# EAGLE design backpac (EAGLE 5.11)
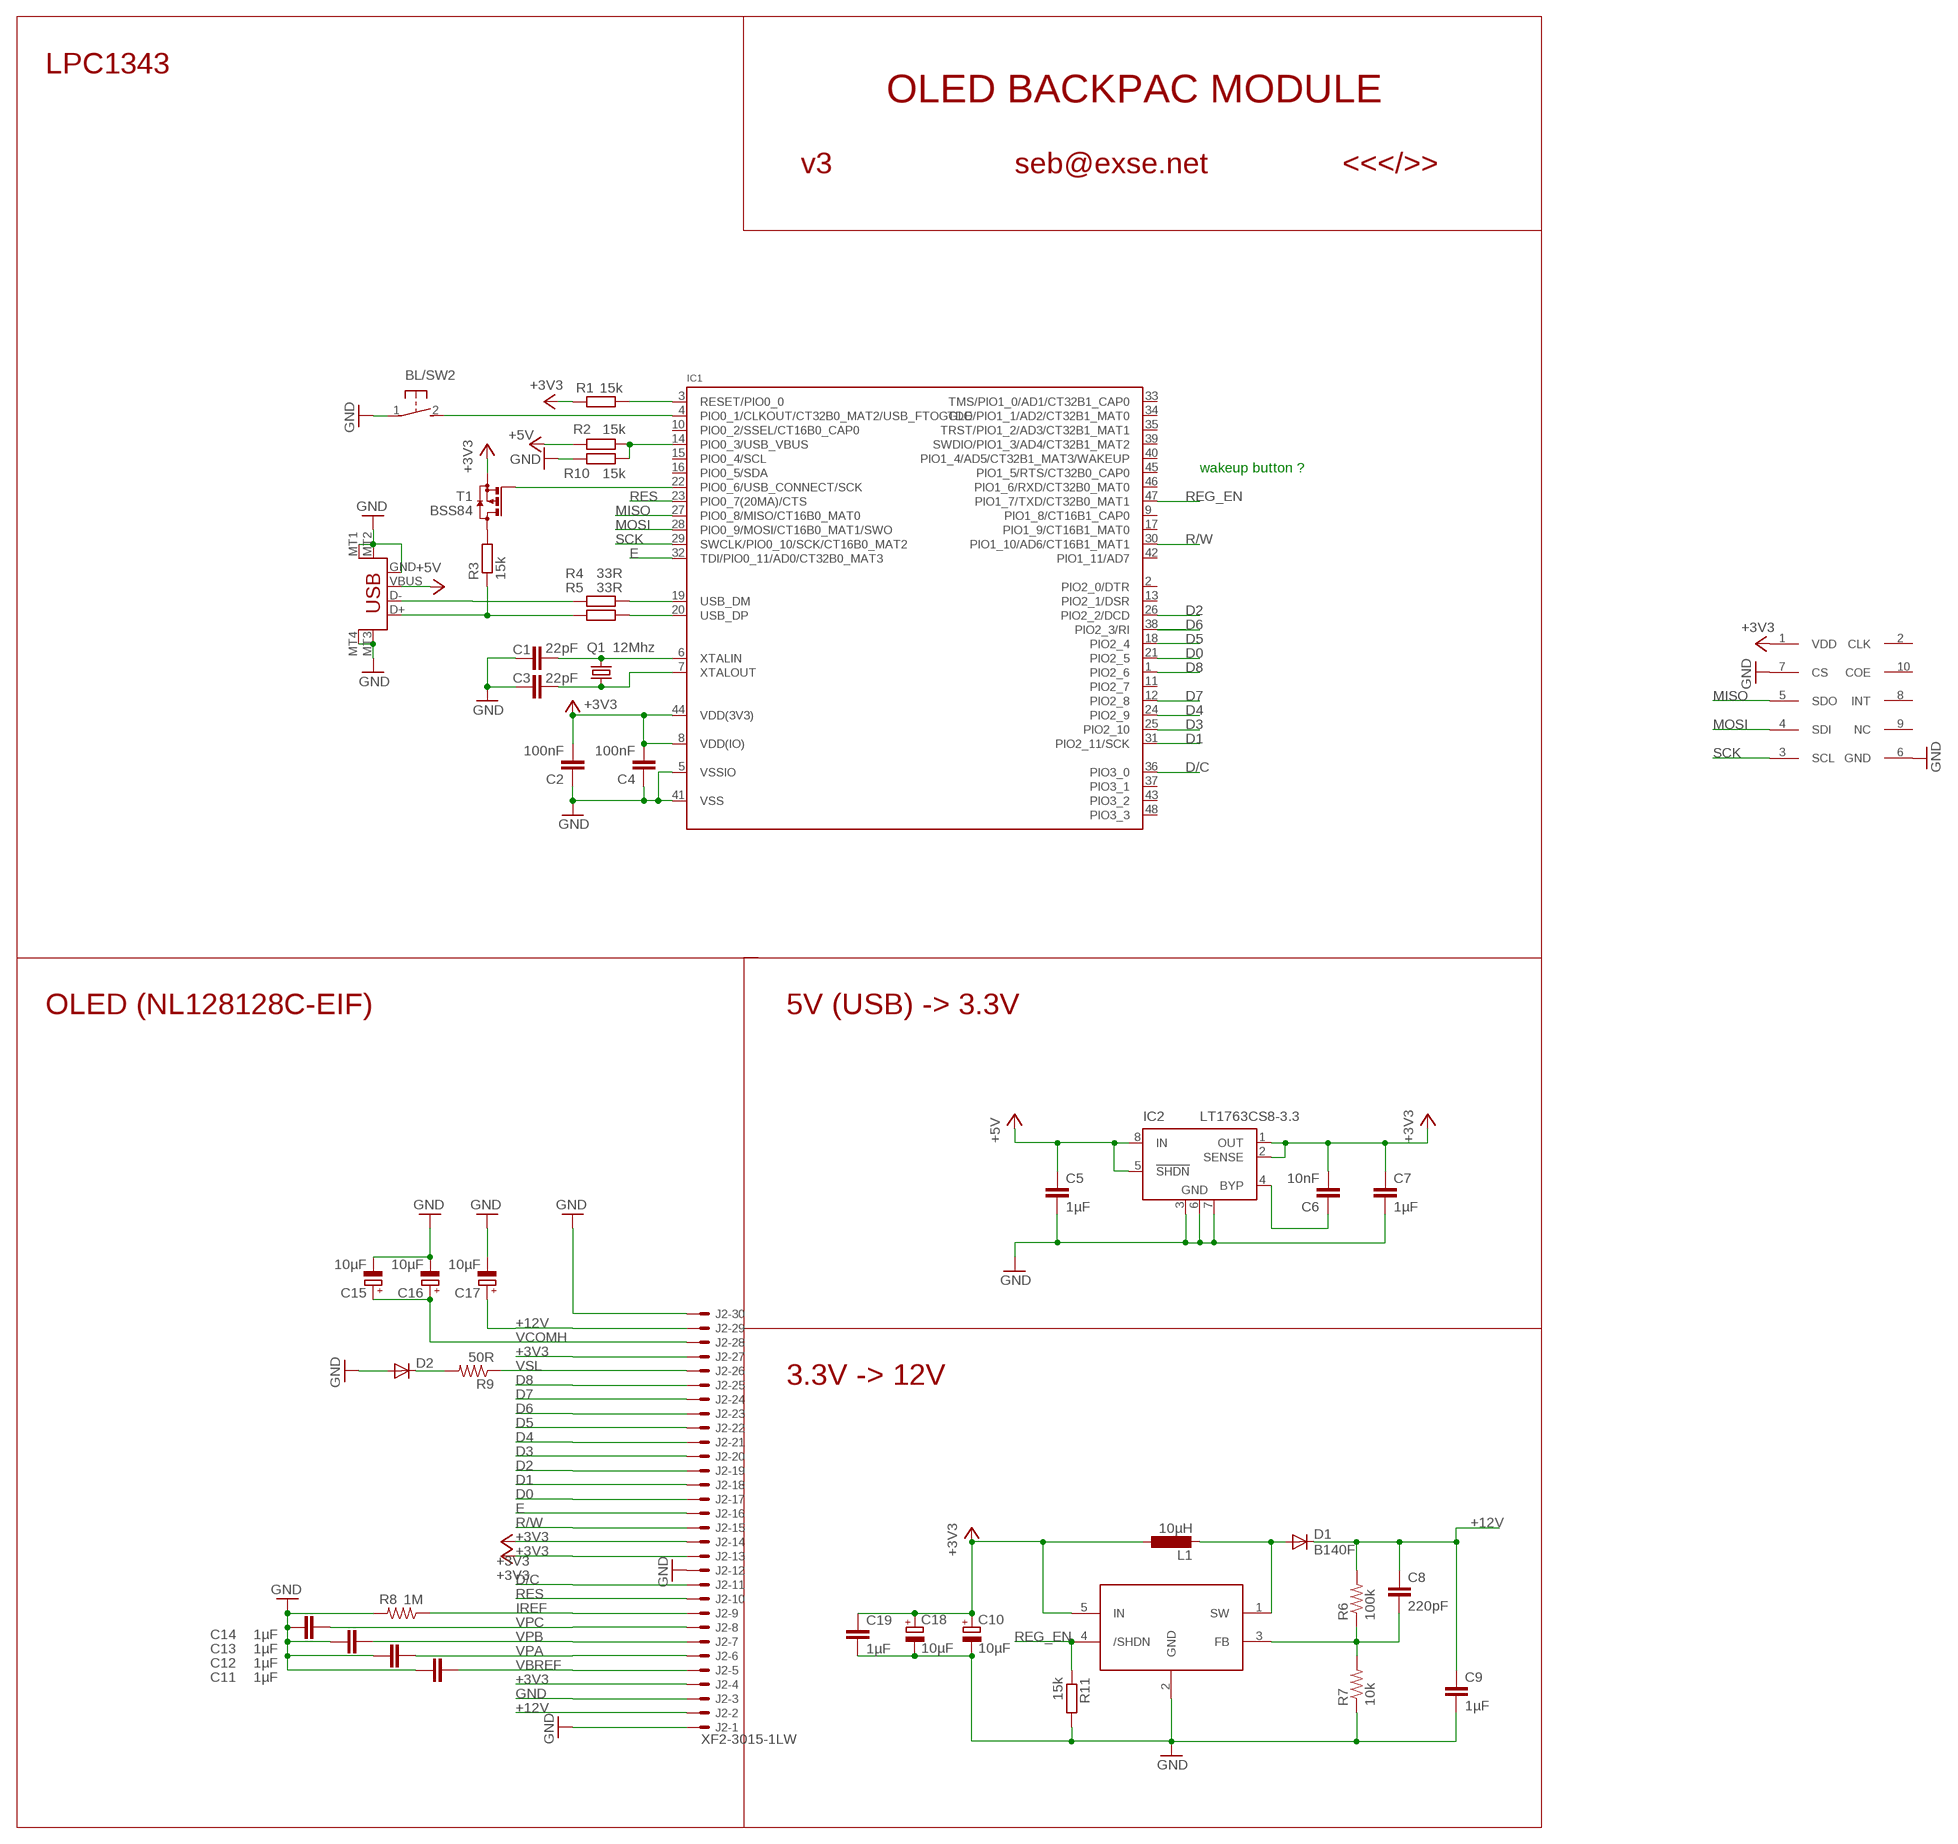
[diagram p0: schematic, sheet 1]

## Parts
BL/SW2  SWITCH_MCTAEF  [SWITCH_MCTAEF]
C1  22pF  C-EUC0402  [C0402]
C2  100nF  C-EUC0402  [C0402]
C3  22pF  C-EUC0402  [C0402]
C4  100nF  C-EUC0402  [C0402]
C5  1µF  CAP0805  [0805]
C6  10nF  C-EUC0402  [C0402]
C7  1µF  CAP0805  [0805]
C8  220pF  CAP0805  [0805]
C9  1µF  CAP0805  [0805]
C10  10µF  CPOL-EUSMCA  [SMC_A]
C11  1µF  CAP0805  [0805]
C12  1µF  CAP0805  [0805]
C13  1µF  CAP0805  [0805]
C14  1µF  CAP0805  [0805]
C15  10µF  CPOL-EUSMCA  [SMC_A]
C16  10µF  CPOL-EUSMCA  [SMC_A]
C17  10µF  CPOL-EUSMCA  [SMC_A]
C18  10µF  CPOL-EUSMCA  [SMC_A]
C19  1µF  CAP0805  [0805]
D1  B140F  DIODE-DO214AC  [DO214AC]
D2  DIODESOD  [SOD-323]
IC1  LPC1343_QFP  [LQFP48]
IC2  LT1763CS8-3.3  [SOIC8]
IC3  LM27313  [SOT23-5L]
IC5  RV-2123-C2  [RV-2123-C2]
J2  XF2-3015-1LW  [XF2H-3015-1LW]
L1  10µH  L-EUL1812  [L1812]
Q1  12Mhz  MT-OSCILLATOR  [MT]
R1  15k  R-EU_R0402  [R0402]
R2  15k  R-EU_R0402  [R0402]
R3  15k  R-EU_R0402  [R0402]
R4  33R  R-EU_R0402  [R0402]
R5  33R  R-EU_R0402  [R0402]
R6  100k  RESISTOR0805-RES  [0805]
R7  10k  RESISTOR0805-RES  [0805]
R8  1M  RESISTOR0805-RES  [0805]
R9  50R  RESISTOR0805-RES  [0805]
R10  15k  R-EU_R0402  [R0402]
R11  15k  R-EU_R0402  [R0402]
T1  BSS84  [SOT23]
X1  USB-MICROB  [USB-MICROB]

## Nets
+3V3: C2.2 C4.2 C6.2 C7.1 C10.+ C18.+ C19.1 IC1.8(VDD(IO)) IC1.44(VDD(3V3)) IC2.1(OUT) IC2.2(SENSE) IC3.5(IN) IC5.1(VDD) J2.4 J2.13 J2.14 J2.27 L1.1 R1.2 T1.2(S)
+5V: C5.1 IC2.5(!SHDN) IC2.8(IN) R2.2 X1.VBUS
+12V: C8.1 C9.1 C17.+ D1.C J2.2 J2.29 R6.2
D0: IC1.21(PIO2_5) J2.17
D1: IC1.31(PIO2_11/SCK) J2.18
D2: IC1.26(PIO2_2/DCD) J2.19
D3: IC1.25(PIO2_10) J2.20
D4: IC1.24(PIO2_9) J2.21
D5: IC1.18(PIO2_4) J2.22
D6: IC1.38(PIO2_3/RI) J2.23
D7: IC1.12(PIO2_8) J2.24
D8: IC1.1(PIO2_6) J2.25
D/C: IC1.36(PIO3_0) J2.11
E: IC1.32(TDI/PIO0_11/AD0/CT32B0_MAT3) J2.16
GND: BL/SW2.1 C1.1 C2.1 C3.1 C4.1 C5.2 C7.2 C9.2 C10.- C11.1 C12.1 C13.1 C14.1 C15.- C16.- C17.- C18.- C19.2 D2.2(A) IC1.5(VSSIO) IC1.41(VSS) IC2.3(GND) IC2.6(GND) IC2.7(GND) IC3.2(GND) IC5.6(GND) IC5.7(CS) J2.1 J2.3 J2.12 J2.30 R7.1 R8.2 R10.2 R11.2 X1.GND X1.MT1(GND) X1.MT2(GND) X1.MT3(GND) X1.MT4(GND)
IREF: J2.9 R8.1
MISO: IC1.27(PIO0_8/MISO/CT16B0_MAT0) IC5.5(SDO)
MOSI: IC1.28(PIO0_9/MOSI/CT16B0_MAT1/SWO) IC5.4(SDI)
N$1: D1.A IC3.1(SW) L1.2
N$2: D2.1(C) R9.2
N$3: C3.2 IC1.7(XTALOUT) Q1.1
N$4: C1.2 IC1.6(XTALIN) Q1.3
N$5: C6.1 IC2.4(BYP)
N$6: C8.2 IC3.3(FB) R6.1 R7.2
N$7: IC1.3(RESET/PIO0_0) R1.1
N$8: R3.2 T1.3(D)
N$9: IC1.22(PIO0_6/USB_CONNECT/SCK) T1.1(G)
N$10: R3.1 R5.2 X1.D+
N$11: R4.2 X1.D-
N$12: IC1.14(PIO0_3/USB_VBUS) R2.1 R10.1
N$14: IC1.19(USB_DM) R4.1
N$21: BL/SW2.2 IC1.4(PIO0_1/CLKOUT/CT32B0_MAT2/USB_FTOGGLE)
N$24: IC1.20(USB_DP) R5.1
R/W: IC1.30(PIO1_10/AD6/CT16B1_MAT1) J2.15
REG_EN: IC1.47(PIO1_7/TXD/CT32B0_MAT1) IC3.4(/SHDN) R11.1
RES: IC1.23(PIO0_7(20MA)/CTS) J2.10
SCK: IC1.29(SWCLK/PIO0_10/SCK/CT16B0_MAT2) IC5.3(SCL)
VBREF: C11.2 J2.5
VCOMH: C15.+ C16.+ J2.28
VPA: C12.2 J2.6
VPB: C13.2 J2.7
VPC: C14.2 J2.8
VSL: J2.26 R9.1
Unconnected: IC1.2(PIO2_0/DTR) IC1.9(PIO1_8/CT16B1_CAP0) IC1.10(PIO0_2/SSEL/CT16B0_CAP0) IC1.11(PIO2_7) IC1.13(PIO2_1/DSR) IC1.15(PIO0_4/SCL) IC1.16(PIO0_5/SDA) IC1.17(PIO1_9/CT16B1_MAT0) IC1.33(TMS/PIO1_0/AD1/CT32B1_CAP0) IC1.34(TDO/PIO1_1/AD2/CT32B1_MAT0) IC1.35(TRST/PIO1_2/AD3/CT32B1_MAT1) IC1.37(PIO3_1) IC1.39(SWDIO/PIO1_3/AD4/CT32B1_MAT2) IC1.40(PIO1_4/AD5/CT32B1_MAT3/WAKEUP) IC1.42(PIO1_11/AD7) IC1.43(PIO3_2) IC1.45(PIO1_5/RTS/CT32B0_CAP0) IC1.46(PIO1_6/RXD/CT32B0_MAT0) IC1.48(PIO3_3) IC5.2(CLK) IC5.8(INT) IC5.9(NC) IC5.10(COE)

## Notes on the sheet
- LPC1343
- OLED BACKPAC MODULE
- v3 | seb@exse.net | <<</>>
- wakeup button ?
- OLED (NL128128C-EIF) | 5V (USB) -> 3.3V
- 3.3V -> 12V

## Library data of the parts
BL/SW2 = seb:SWITCH_MCTAEF
C1-C4 C6 = rcl:C-EU: CAPACITOR, European symbol
C5 C7-C9 C11-C14 C19 = SparkFun:CAP: Capacitor Standard 0603 ceramic capacitor, and 0.1" leaded capacitor.
C10 C15-C18 = rcl:CPOL-EU: POLARIZED CAPACITOR, European symbol
D1 = diode:DIODE-: DIODE
D2 = SparkFun:DIODE: Diode These are standard reverse protection diodes and small signal diodes. SMA package can handle up to about 1A. SOD-323 can handle about 200mA. What the SOD-323 package when ordering, there are some mfgs out there that are 5-pin packages.
IC1 = microbuilder:LPC1343_QFP: LPC1343 72 MHz 32-bit ARM Cortex-M3 microcontroller. 32 kB Flash, 8 kB SRAM, USB Device Mouser: 771-LPC1343FBD48151 Digikey: 568-4945-ND; DIGIKEY#: 568-4945-ND; MANF: NXP; MANF#: LPC1343FBD48,151
IC2 = linear-technology:LT1763CS8: 500mA, Low Noise, LDO Micropower Regulators Source: http://cds.linear.com/docs/Datasheet/1763ff.pdf; MPN: LT1763CS8-3.3; OC_FARNELL: 1273617; OC_NEWARK: 57M6055
IC3 = seb:LM27313
IC5 = seb:RV-2123-C2
J2 = con-omron:XF2*-30?: OMRON FPC Connector Source : http://www.omron.com/ecb/products/pdf/fpc.pdf; OC_FARNELL: unknown; OC_NEWARK: unknown
L1 = resistor:L-EU: INDUCTOR, European symbol
Q1 = seb:MT-OSCILLATOR
R1-R5 R10 R11 = rcl:R-EU_: RESISTOR, European symbol
R6-R9 = SparkFun:RESISTOR: Resistor Basic schematic elements and footprints for 0603, 1206, and PTH resistors.
T1 = transistor-small-signal:BSS84: P-CHANNEL MOS FET
X1 = SparkFun:USB: USB Connectors USB-B-PTH is fully proven SKU : PRT-00139 USB-miniB is fully proven SKU : PRT-00587 USB-A-PCB is untested. USB-A-H is throughly reviewed, but untested. Spark Fun Electronics SKU : PRT-00437 USB-B-SMT is throughly reviewed, but untested. Needs silkscreen touching up. USB-A-S has not been used/tested USB-MB-H has not been used/tested

## Board
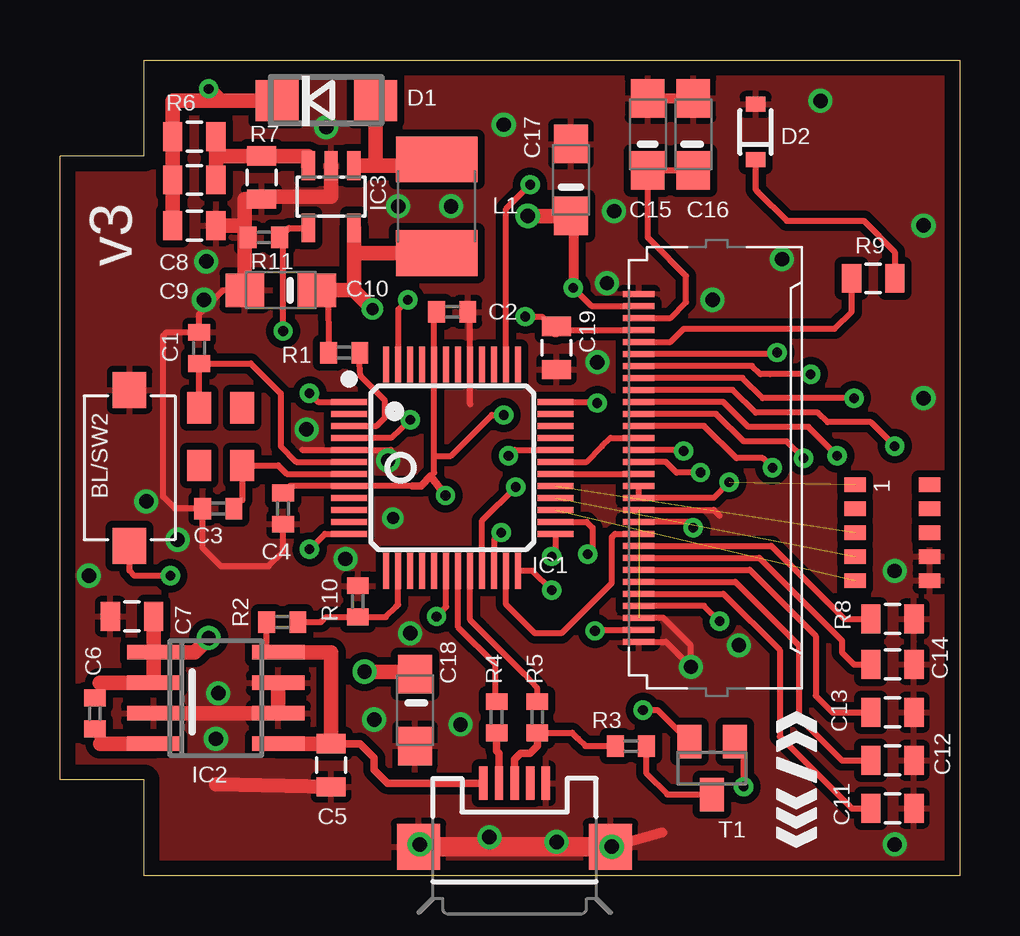
[diagram p1: board, top side]
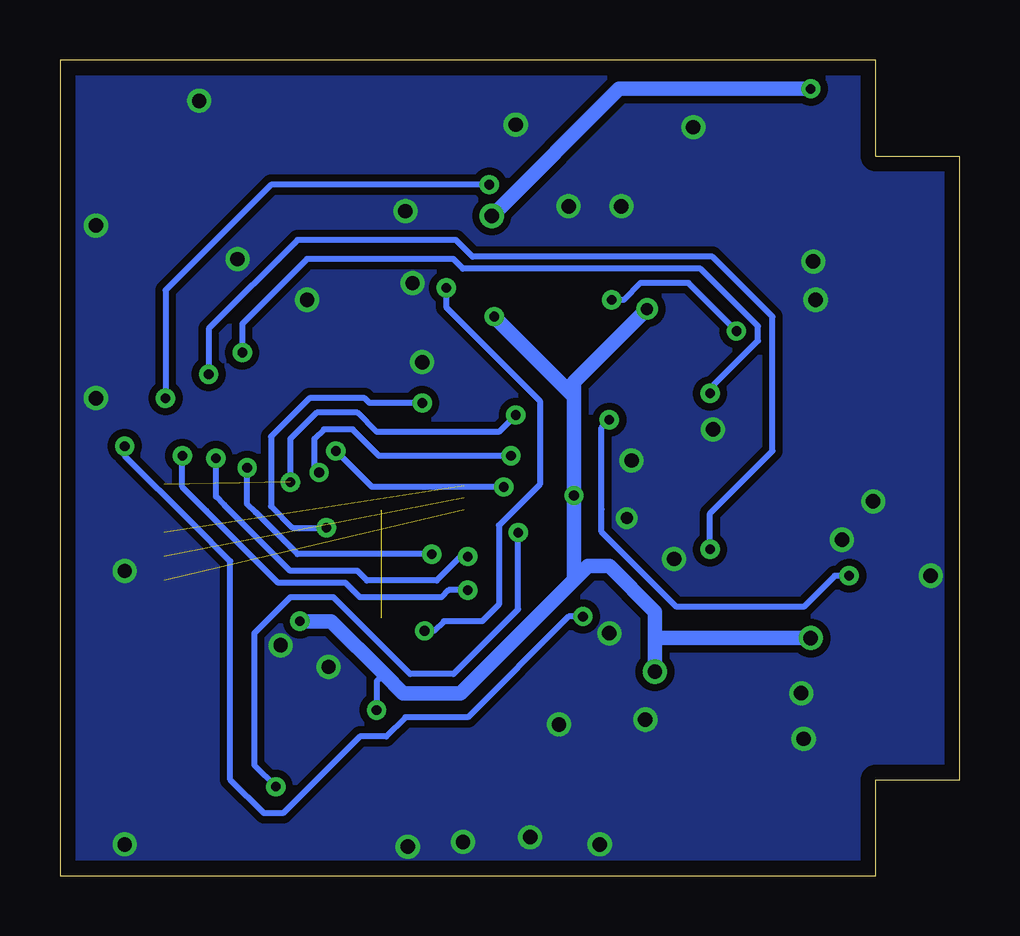
[diagram p2: board, bottom side, seen from below]

Size 37.5 x 34 mm. Coordinates in mm from the lower left corner, seen from the top.
Outline: 37.5,34 37.5,0 3.5,0 3.5,4 0,4 0,30 3.5,30 3.5,34 37.5,34
Copper layers (1*16): Top 0.035mm / dielectric 1.5mm / Bottom 0.035mm
Design rules "default *": minimum track width 9mil, minimum drill 0.4mm, track to track 8mil, track to pad 8mil, pad to pad 8mil, via to via 8mil, smd to smd 8mil, copper to edge 25mil, drill to drill 8mil, minimum pad ring 10mil, minimum via ring 8mil, stop-mask expansion 4mil, vias tented up to drill 30mil, thermal gap 10mil

### Footprints (pad centres in the part's own frame; a part is rotated, then mirrored left to right if it is on the bottom)
SWITCH_MCTAEF = smd 1.5 x 1.4: 1 -3.25,0; 2 3.25,0
C0402 = smd 0.7 x 0.9: 1 -0.65,0; 2 0.65,0
0805 = smd 0.8 x 1.2: 1 -0.9,0; 2 0.9,0
SMC_A = smd 1.6 x 1.4: + -1.5,0; - 1.5,0
DO214AC = smd 1.8 x 1.7: A 2.05,0; C -2.05,0
SOD-323 = smd 0.63 x 0.83: 1 -1.15,0; 2 1.15,0
LQFP48 = smd 1.5 x 0.25: 1 -4.3,2.75; 2 -4.3,2.25; 3 -4.3,1.75; 4 -4.3,1.25; 5 -4.3,0.75; 6 -4.3,0.25; 7 -4.3,-0.25; 8 -4.3,-0.75; 9 -4.3,-1.25; 10 -4.3,-1.75; 11 -4.3,-2.25; 12 -4.3,-2.75; 25 4.3,-2.75; 26 4.3,-2.25; 27 4.3,-1.75; 28 4.3,-1.25; 29 4.3,-0.75; 30 4.3,-0.25; 31 4.3,0.25; 32 4.3,0.75; 33 4.3,1.25; 34 4.3,1.75; 35 4.3,2.25; 36 4.3,2.75 | smd 0.25 x 1.5: 13 -2.75,-4.3; 14 -2.25,-4.3; 15 -1.75,-4.3; 16 -1.25,-4.3; 17 -0.75,-4.3; 18 -0.25,-4.3; 19 0.25,-4.3; 20 0.75,-4.3; 21 1.25,-4.3; 22 1.75,-4.3; 23 2.25,-4.3; 24 2.75,-4.3; 37 2.75,4.3; 38 2.25,4.3; 39 1.75,4.3; 40 1.25,4.3; 41 0.75,4.3; 42 0.25,4.3; 43 -0.25,4.3; 44 -0.75,4.3; 45 -1.25,4.3; 46 -1.75,4.3; 47 -2.25,4.3; 48 -2.75,4.3
SOIC8 = smd 0.6 x 2.2: 1 -1.905,-2.6; 2 -0.635,-2.6; 3 0.635,-2.6; 4 1.905,-2.6; 5 1.905,2.6; 6 0.635,2.6; 7 -0.635,2.6; 8 -1.905,2.6
SOT23-5L = smd 0.55 x 1.2: 1 -0.95,-1.3; 2 0,-1.3; 3 0.95,-1.3; 4 0.95,1.3; 5 -0.95,1.3
RV-2123-C2 = smd 0.6 x 0.9: 1 -2,-1.55; 2 -1,-1.55; 3 0,-1.55; 4 1,-1.55; 5 2,-1.55; 6 2,1.55; 7 1,1.55; 8 0,1.55; 9 -1,1.55; 10 -2,1.55
XF2H-3015-1LW = smd 1.3 x 0.25: 1 3.175,7.25; 2 3.175,6.75; 3 3.175,6.25; 4 3.175,5.75; 5 3.175,5.25; 6 3.175,4.75; 7 3.175,4.25; 8 3.175,3.75; 9 3.175,3.25; 10 3.175,2.75; 11 3.175,2.25; 12 3.175,1.75; 13 3.175,1.25; 14 3.175,0.75; 15 3.175,0.25; 16 3.175,-0.25; 17 3.175,-0.75; 18 3.175,-1.25; 19 3.175,-1.75; 20 3.175,-2.25; 21 3.175,-2.75; 22 3.175,-3.25; 23 3.175,-3.75; 24 3.175,-4.25; 25 3.175,-4.75; 26 3.175,-5.25; 27 3.175,-5.75; 28 3.175,-6.25; 29 3.175,-6.75; 30 3.175,-7.25
L1812 = smd 1.9 x 3.4: 1 -1.95,0; 2 1.95,0
MT = smd 1.3 x 1: 1 1.2,0.9; 2 -1.2,0.9; 3 -1.2,-0.9; 4 1.2,-0.9
R0402 = smd 0.7 x 0.9: 1 -0.65,0; 2 0.65,0
SOT23 = smd 1 x 1.4: 1 -0.95,-1.1; 2 0.95,-1.1; 3 0,1.1
USB-MICROB = smd 0.35 x 1.4: D+ 0,2.65; D- -0.65,2.65; GND 1.3,2.65; ID 0.65,2.65; VBUS -1.3,2.65 | smd 1.8 x 1.9: MT1 -4,0; MT2 4,0; MT3 -4,0; MT4 4,0

### Placement (x,y rotation side)
BL/SW2  2.9,17 270 top
C1  5.8,22 270 top
C2  16.35,23.5 180 top
C3  6.6,15.3 0 top
C4  9.3,15.3 90 top
C5  11.3,4.6 270 top
C6  1.46,6.76 90 top
C7  3,10.8 180 top
C8  5.6,29 0 top
C9  5.6,27.1 0 top
C10  9.2,24.4 180 top
C11  34.7,2.8 180 top
C12  34.7,4.8 180 top
C13  34.7,6.8 180 top
C14  34.7,8.8 180 top
C15  24.5,30.9 90 top
C16  26.4,30.9 90 top
C17  21.3,29 90 top
C18  14.8,6.9 270 top
C19  20.7,22 270 top
D1  11.1,32.3 0 top
D2  29,31 90 top
IC1  16.35,17 0 top
IC2  6.5,7.4 270 top
IC3  11.3,28.3 180 top
IC5  34.7,14.3 270 top
J2  27.3,17 180 top
L1  15.7,27.9 90 top
Q1  6.7,18.3 270 top
R1  11.85,21.8 180 top
R2  9.27,10.57 180 top
R3  23.8,5.4 0 top
R4  18.2,6.6 270 top
R5  19.9,6.6 270 top
R6  5.6,30.8 180 top
R7  8.4,29.1 90 top
R8  34.7,10.7 0 top
R9  33.9,24.9 0 top
R10  12.42,11.43 90 top
R11  8.5,26.6 180 top
T1  27.18,4.48 180 top
X1  18.95,1.2 0 top

### Tracks (layer width: path | path; a pad name or v marks a point on that pad's centre or on a via)
+3V3  (via drill 0.4, 0.5, 0.6)  (1 unrouted)
  Top 0.254: 20.65,22.75 20.1,23.3 v19.4,23.3 | C2.2 15.6,23.4 IC1.44 15.6,17.5 | C4.2 9.6,16.25 IC1.8 14.7,16.25 | v27.5,10.6 26.85,11.25 J2.4 | R1.2 11.18,24.43 12.32,24.32 | 15.6,17.5 15.6,16.8 15.05,16.25 | C6.2 1.65,7.45 1.65,8.04 | T1.2 24.91,6.9 v24.3,6.9 | J2.27 20.85,22.75 C19.1 | J2.14 J2.13 27.25,15.75 v27.9,16.4 | v18.5,19.2 18,19.2 16.3,17.5 15.6,17.5
  Top 0.305: 14.7,16.25 15.05,16.25 15.44,16.65 v16.07,15.85
  Top 0.61: 12.25,24.4 IC3.5 12.25,25.95 L1.1 | 12.25,24.4 C10.+ | IC2.1 4,9.3 | 1.65,8.04 IC2.2 IC2.1 | IC2.1 C7.1 | 12.25,24.4 12.32,24.32 v13.03,23.62 | C18.+ 14.8,8.5 v12.7,8.5 | 20.65,22.75 20.65,22.85 C19.1 | v6.2,9.9 5.61,9.3 IC2.1
  Bottom 0.254: v24.3,6.9 24.3,8.1 24,8.4 | v27.9,16.4 27.9,18.2 26.8,19.3 25.1,19.3 24.3,18.5 19.2,18.5 v18.5,19.2
  Bottom 0.61: v27.5,10.6 26.2,10.6 24,8.4 23.2,7.6 20.8,7.6 16.07,12.33 | 16.07,12.33 v16.07,15.85 16.07,19.97 | v6.2,9.9 12.7,9.9 | 12.7,9.9 v12.7,8.5 | 16.07,12.33 15.5,12.9 14.6,12.9 12.7,11 12.7,9.9 | 16.07,19.97 v19.4,23.3 | v13.03,23.62 16.08,20.57 16.07,19.97
+5V
  Top 0.254: R2.2 8.62,9.3 IC2.8
  Top 0.305: X1.VBUS 13.65,3.85 13.1,4.4 13.1,4.9 12.8,5.2 12.5,5.5 C5.1
  Top 0.35: 10.9,5.5 11.25,5.85
  Top 0.61: C5.1 9.2,5.5 IC2.5 10.9,5.5 C5.1 | C5.1 11.3,9.3 IC2.8
+12V  (via drill 0.4, 0.6)
  Top 0.254: v21.4,24.5 22.15,23.75 J2.29 | 22.35,10.25 v22.3,10.2 22.35,10.25 | 22.35,10.25 J2.2
  Top 0.406: C17.+ 21.4,27.4 v21.4,24.5
  Top 0.61: C9.1 C8.1 R6.2 4.7,32.3 D1.C 6.7,32.3 v6.2,32.8 | v19.5,27.5 C17.+
  Bottom 0.254: v21.4,24.5 21.4,23.7 17.49,19.79 17.49,16.31 19.2,14.6 19.2,11.3 19.9,10.6 21.5,10.6 21.9,10.2 v22.3,10.2
  Bottom 0.61: v6.2,32.8 13.4,32.8 14.2,32.8 v19.5,27.5
D0  (via drill 0.4)
  Top 0.254: v26,17.7 25.95,17.75 J2.17 | IC1.21 17.6,14.8 v19,16.2
  Bottom 0.254: v19,16.2 24.5,16.2 v26,17.7
D1
  Top 0.254: J2.18 22.95,18.25 22.6,17.9 21.95,17.25 IC1.31
D2  (via drill 0.4)
  Top 0.254: IC1.26 21.95,14.75 22.2,14.5 22.2,13.6 v22,13.4 | J2.19 26.85,18.75 28.2,17.4 29.3,17.4 v29.7,17
  Bottom 0.254: v22,13.4 27.6,13.4 29.35,15.15 29.7,15.5 v29.7,17
D3  (via drill 0.4)
  Top 0.254: IC1.25 20.65,13.45 v20.5,13.3 | J2.20 27.35,19.25 28.5,18.1 30.3,18.1 v31,17.4
  Bottom 0.254: v20.5,13.3 20.8,13.3 21.8,12.3 24.7,12.3 25.1,12.7 27.9,12.7 30.65,15.45 | 30.65,15.45 31,15.8 | 31,15.8 v31,17.4 | 30.65,15.45 31,15.8
D4  (via drill 0.4)
  Top 0.254: IC1.24 19.7,12.7 v20.5,11.9 | v32.4,17.5 31.2,18.7 28.7,18.7 27.65,19.75 J2.21
  Bottom 0.254: v20.5,11.9 21.3,11.9 21.6,11.6 25,11.6 25.6,12.2 28.4,12.2 31.4,15.2 32.4,16.2 v32.4,17.5
D5  (via drill 0.4)
  Top 0.254: IC1.18 16.1,11.2 v15.7,10.8 | v34.8,17.9 33.8,18.9 32,18.9 31.6,19.3 29,19.3 28.05,20.25 J2.22
  Bottom 0.254: v15.7,10.8 16.3,10.8 20.5,6.6 23.1,6.6 23.9,5.8 25,5.8 28.2,2.6 29,2.6 30.4,4 30.4,13.1 32,14.7 34.8,17.5 v34.8,17.9
D6  (via drill 0.4)
  Top 0.254: IC1.38 18.6,27.8 v19.6,28.8 | v33.1,19.9 29.3,19.9 28.45,20.75 J2.23
  Bottom 0.254: v19.6,28.8 28.7,28.8 33.1,24.4 v33.1,19.9
D7  (via drill 0.4)
  Top 0.254: IC1.12 11.05,14.25 v10.4,13.6 | v31.3,20.9 29.6,20.9 | 29.6,20.9 29.2,20.9 | 29.6,20.9 29.2,20.9 | 29.6,20.9 29.2,20.9 | 29.2,20.9 28.85,21.25 J2.24
  Bottom 0.254: v10.4,13.6 10.4,15.1 7.8,17.7 7.8,23.3 10.3,25.8 20.3,25.8 21,26.5 27.6,26.5 31.3,22.8 v31.3,20.9
D8  (via drill 0.4)
  Top 0.254: IC1.1 10.75,19.75 v10.4,20.1 | v29.9,21.8 29.55,21.75 J2.25
  Bottom 0.254: v10.4,20.1 10.4,20.3 8.4,22.3 8.4,22.9 10.8,25.3 20.7,25.3 21.1,25.7 27.2,25.7 29.9,23 v29.9,21.8
D/C  (via drill 0.4)
  Top 0.254: IC1.36 22.35,19.75 v22.4,19.7 | J2.11 26.15,14.75 v26.4,14.5
  Bottom 0.254: v22.4,19.7 24.6,19.7 24.8,19.9 27.1,19.9 28.7,18.3 28.7,15.4 27.8,14.5 v26.4,14.5
E  (via drill 0.4)
  Top 0.254: IC1.32 18.95,17.75 v18.7,17.5 | v26.7,16.8 25.7,16.8 25.4,17.1 25.25,17.25 J2.16
  Bottom 0.254: v18.7,17.5 24.2,17.5 25.3,18.6 26.5,18.6 26.9,18.2 26.9,17 v26.7,16.8
GND  (via drill 0.5, 0.6)  (1 unrouted)
  Top 0.254: 17.1,19.65 IC1.41 17.1,23.4 C2.1 | C4.1 9.3,13.5 8.7,12.9 6.7,12.9 5.95,13.65 C3.1 4.8,15.3 4.3,15.8 4.3,22.5 4.45,22.65 C1.1 5.8,23.4 6.8,24.4 C10.- | 10.1,17.75 IC1.5 13.8,17.75 13.45,17.3 v13.68,17.3 | J2.1 25.25,9.75 v26.3,8.7 26.3,9.6 25.15,10.75 J2.3 | J2.12 27.25,15.25 27.5,15
  Top 0.406: X1.MT4 25.1,1.8 | C15.- C16.-
  Top 0.61: 7.7,27.1 7.7,28.2 R7.1 8.4,28.3 11.3,28.3 IC3.2 | C10.- 7.7,27.1 | 7.7,27.1 C9.2 | 6.5,3.8 C5.2 | IC2.3 IC2.6 IC2.7
  Top 0.813: X1.MT1 X1.MT4
  other vias: 31.7,32.3 30.1,25.7 11.1,31.2 6.1,25.6 6,24 18.5,31.3 4.9,14 11.9,13.2 6.6,7.6 6.5,5.7 17.9,1.6 20.7,1.4 34.8,1.3 36,27.1 27.2,24 22.8,24.7 13.88,14.9 22.4,21.4 16.7,6.3 23,1.2 15,1.3 36,19.9 13.1,6.5 23.1,27.7 10.28,18.6 14.6,10.1 34.8,12.7 16.3,27.9 14.1,27.9 28.3,9.6 1.2,12.5 3.6,15.6
  pour Top (isolate 0.305): 38,34.5 0,34.5 0,-0.5 38,-0.5
  pour Bottom (isolate 0.305): 38,34.5 0,34.5 0,-0.5 38,-0.5
IREF
  Top 0.254: J2.9 29.65,13.75 32.7,10.7 R8.1
MISO  (1 unrouted)
MOSI  (1 unrouted)
N$1
  Top 0.61: L1.2 15.7,29.6 IC3.1 13.15,29.6 D1.A
N$2
  Top 0.254: R9.2 34.8,26 33.5,27.3 30.3,27.3 29.1,28.5 29,28.6 D2.1
N$3
  Top 0.254: IC1.7 9.45,16.75 9.1,17.1 Q1.1 7.6,15.65 C3.2
N$4
  Top 0.254: IC1.6 9.85,17.25 9.2,17.9 9.2,20.1 7.95,21.35 C1.2 Q1.3
N$5
  Top 0.254: C6.1 1.4,5.95 1.77,5.5
  Top 0.61: IC2.4 1.77,5.5 1.68,5.5
N$6
  Top 0.61: IC3.3 10.35,30 R7.2 6.5,30 | C8.2 6.5,30 | 6.5,30 R6.1
N$7
  Top 0.254: IC1.3 13.2,18.75 13.55,19.1 13.55,19.8 12.53,20.82 12.47,21.57 R1.1
N$8
  Top 0.254: T1.3 25.32,3.38 24.45,4.25 R3.2
N$9  (via drill 0.4)
  Top 0.254: IC1.22 18.1,14 v18.4,14.3 | v28.5,3.7 28.5,4.91 T1.1
  Bottom 0.254: v18.4,14.3 18.4,11.1 21.1,8.4 22.9,8.4 26.1,11.6 27.9,11.6 29.4,10.1 29.4,4.6 v28.5,3.7
N$10
  Top 0.254: R3.1 21.9,5.4 21.6,5.7 21.35,5.95 R5.2
  Top 0.305: X1.D+ 18.95,4.85 19.2,5.1 19.6,5.1 19.8,5.3 19.9,5.4 R5.2
N$11
  Top 0.305: X1.D- 18.3,5.1 18.2,5.2 R4.2
N$12
  Top 0.254: R2.1 10.87,10.57 10.9,10.6 11.08,10.78 R10.1 13.58,10.78 14,11.2 14.1,11.3 IC1.14
N$14
  Top 0.254: R4.1 18.15,7.55 18.15,8.8 16.6,10.35 IC1.19
N$21  (via drill 0.4)
  Top 0.254: IC1.4 13.8,18.25 v14.6,19 | BL/SW2.2 2.9,12.7 3.1,12.5 3.7,12.5 v4.6,12.5
  Bottom 0.254: v14.6,19 14.93,18.68 14.93,15.28 14.93,14.32 14.4,13.8 11.8,11.2 6.5,11.2 5.2,12.5 v4.6,12.5
N$24
  Top 0.254: IC1.20 17.1,10.65 19.35,8.4 19.9,7.8 R5.1
R/W
  Top 0.254: IC1.30 J2.15
REG_EN  (via drill 0.4)
  Top 0.254: v14.5,24 14.1,23.6 IC1.47 | v9.3,22.7 9.3,26.45 | R11.1 9.55,27 IC3.4
  Top 0.406: 9.3,26.45 9.15,26.45 R11.1
  Bottom 0.254: v14.5,24 14,24 13.3,24.7 11.3,24.7 v9.3,22.7
RES
  Top 0.254: IC1.23 18.6,11.3 19.8,10.1 20.9,10.1 23,12.2 23,14.1 23.1,14.2 23.15,14.25 J2.10
SCK  (1 unrouted)
VBREF
  Top 0.254: C11.2 33,2.8 30,5.8 30,9.4 27.65,11.75 J2.5
VCOMH
  Top 0.254: C16.+ C15.+ 24.5,26.6 24.7,26.4 26.1,25 26.1,23.9 25.45,23.25 J2.28
VPA
  Top 0.254: C12.2 32.6,4.8 30.8,6.6 30.8,9.6 28.15,12.25 J2.6
VPB
  Top 0.254: C13.2 32.2,6.8 31.5,7.5 31.5,10 28.75,12.75 J2.7
VPC
  Top 0.254: J2.8 29.15,13.25 32.6,9.8 32.6,9.3 33.1,8.8 C14.2
VSL
  Top 0.254: R9.1 33,23.5 32.3,22.8 26,22.8 25.45,22.25 J2.26

### Text on the board
tPlace: v3
tValues: LPC1343 | 12Mhz
bStop: seb@exse.net | oled module v1